# Altium schematic sheet BMS Carrier - Battery Relay Controls.SchDoc: Relay Control
size Tabloid; Author: Liam Sky, Annika Logarta; Revision: 1.0; SheetNumber: 4; SheetTotal: 4; Website: www.uwmidsun.com
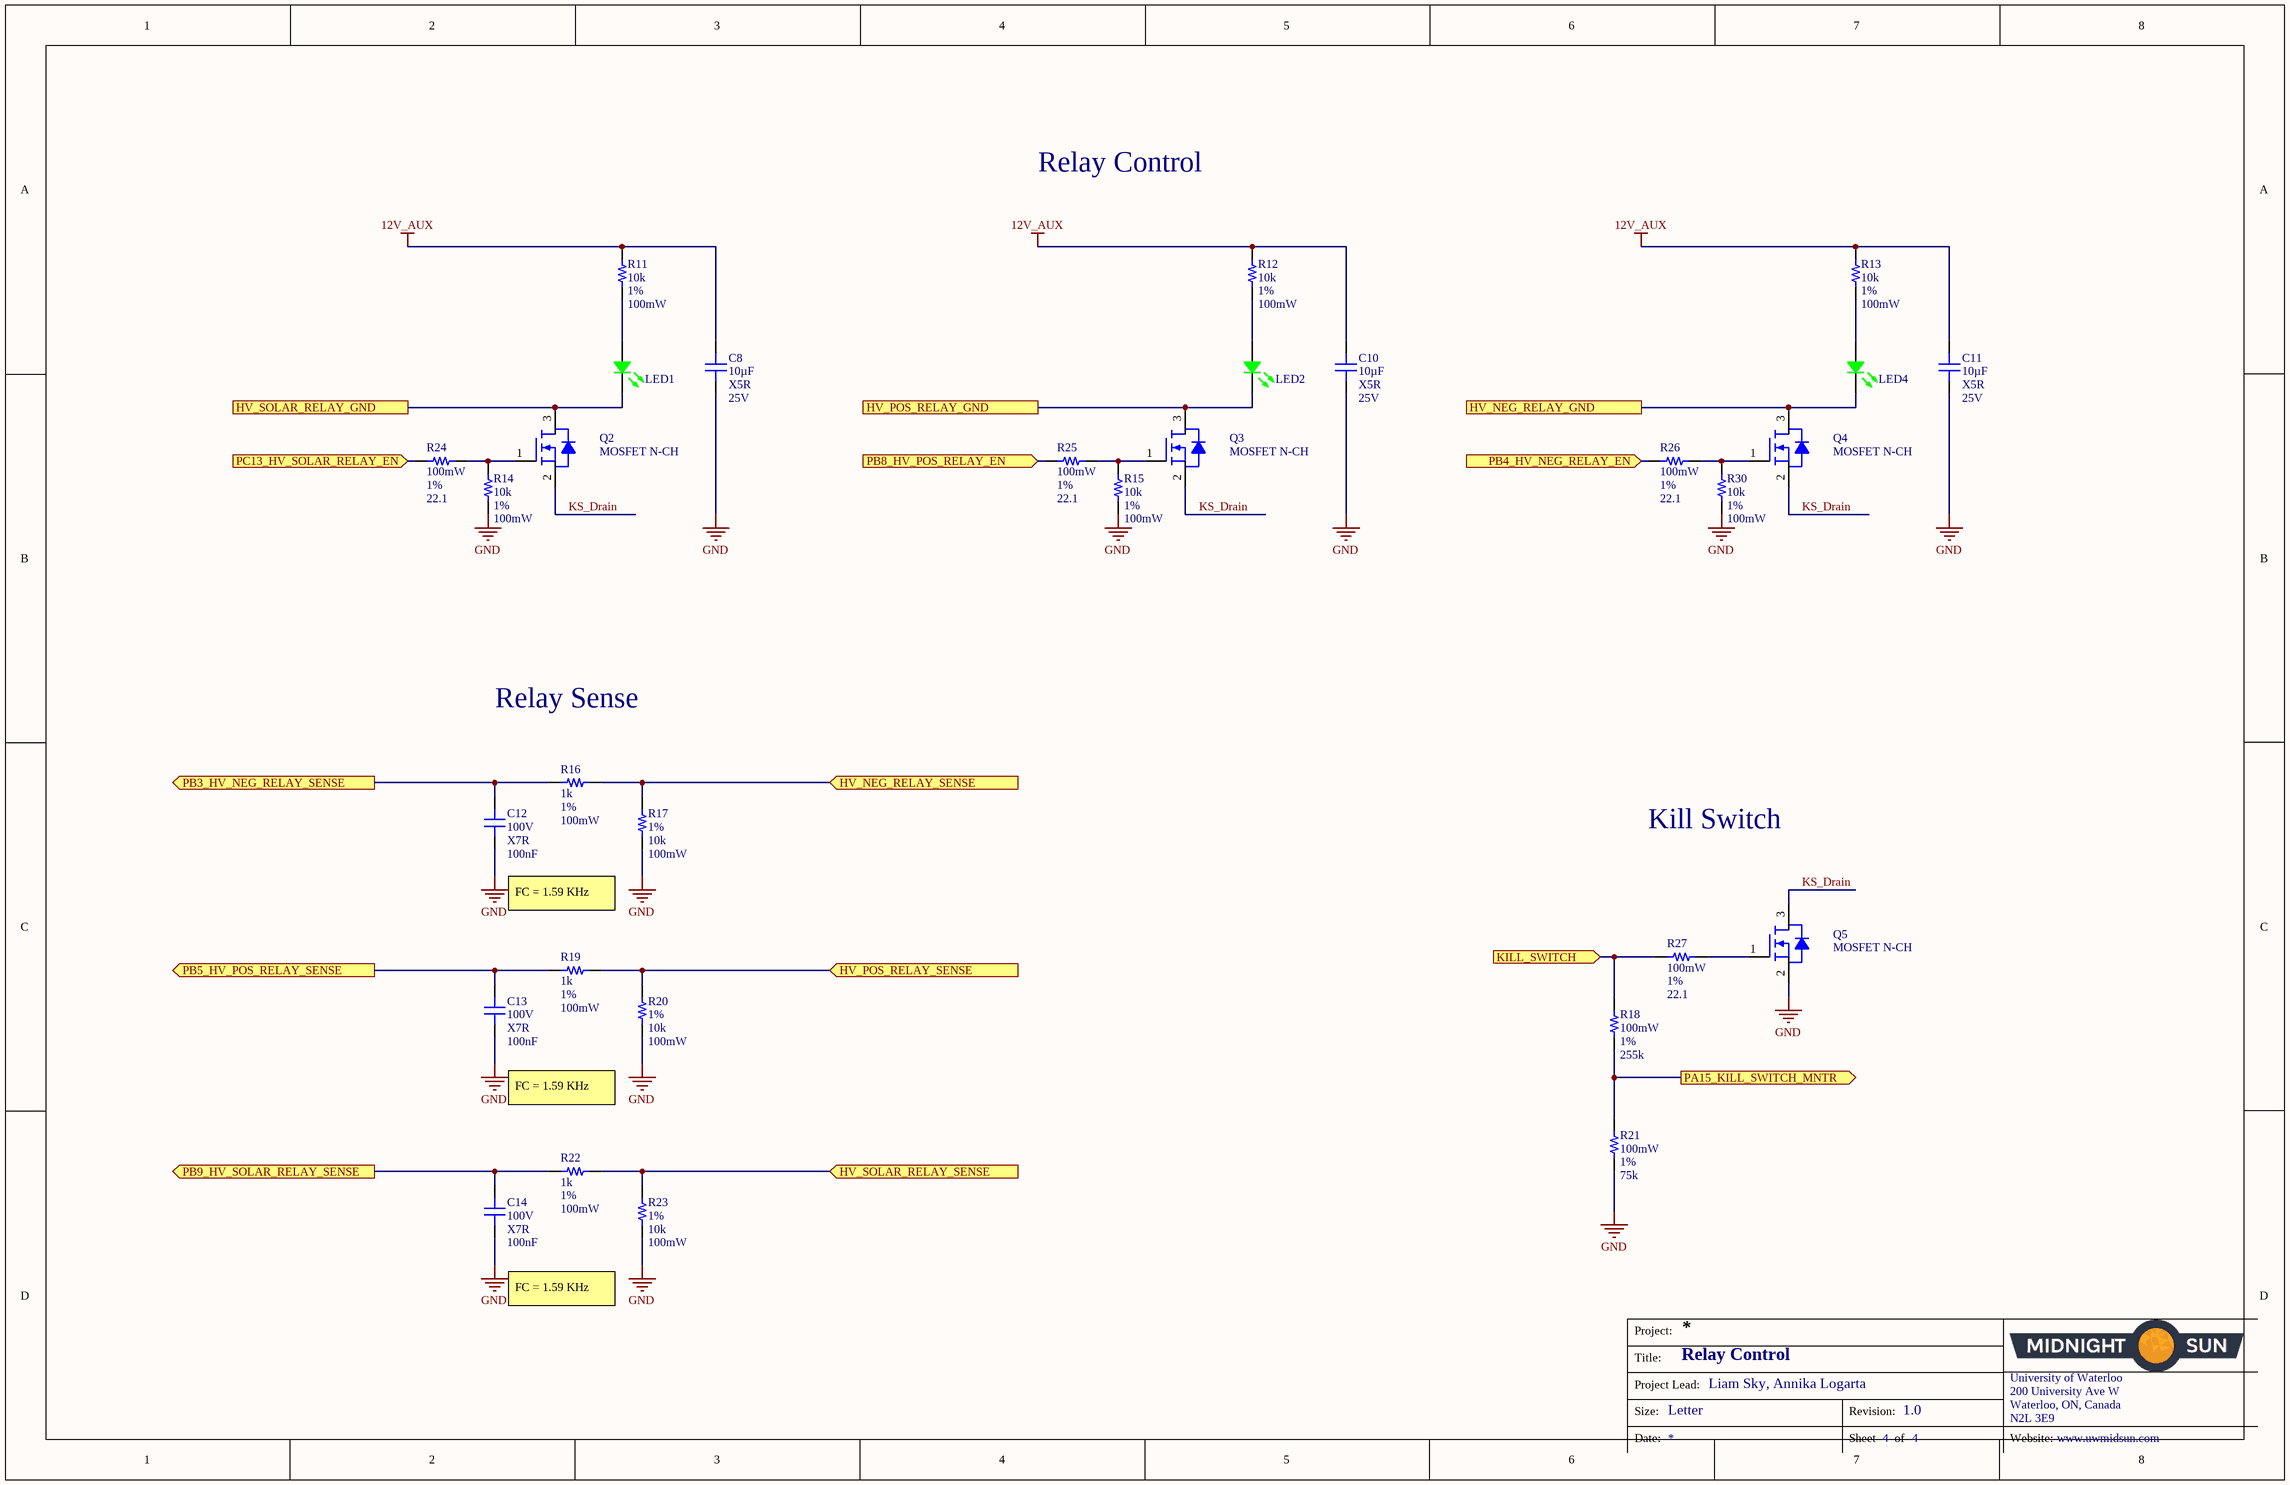
[diagram p0: BMS Carrier - Battery Relay Controls.SchDoc]

## Parts
C8  Capacitance: 10µF  Dielectric Code: X5R  Voltage Rating: 25V  [CAP 0603_1608]  (hidden comment: CAP CER 10UF 25V 20% X5R 0603)
C10  Capacitance: 10µF  Dielectric Code: X5R  Voltage Rating: 25V  [CAP 0603_1608]  (hidden comment: CAP CER 10UF 25V 20% X5R 0603)
C11  Capacitance: 10µF  Dielectric Code: X5R  Voltage Rating: 25V  [CAP 0603_1608]  (hidden comment: CAP CER 10UF 25V 20% X5R 0603)
C12  Voltage Rating: 100V  Dielectric Code: X7R  Capacitance: 100nF  [CAP 0603_1608]  (hidden comment: CAP CER 0.1UF 100V 10% X7R 0603)
C13  Voltage Rating: 100V  Dielectric Code: X7R  Capacitance: 100nF  [CAP 0603_1608]  (hidden comment: CAP CER 0.1UF 100V 10% X7R 0603)
C14  Voltage Rating: 100V  Dielectric Code: X7R  Capacitance: 100nF  [CAP 0603_1608]  (hidden comment: CAP CER 0.1UF 100V 10% X7R 0603)
LED1  LED GREEN CLEAR 2V 0603  [LED 0603_1608]  (value not drawn)
LED2  LED GREEN CLEAR 2V 0603  [LED 0603_1608]  (value not drawn)
LED4  LED GREEN CLEAR 2V 0603  [LED 0603_1608]  (value not drawn)
Q2  MOSFET N-CH  [SOT 23-3]
Q3  MOSFET N-CH  [SOT 23-3]
Q4  MOSFET N-CH  [SOT 23-3]
Q5  MOSFET N-CH  [SOT 23-3]
R11  Resistance: 10k  Tolerance: 1%  Power Rating: 100mW  [RES 0603_1608]  (hidden comment: RES 10K OHM 1% 1/10W 0603)
R12  Resistance: 10k  Tolerance: 1%  Power Rating: 100mW  [RES 0603_1608]  (hidden comment: RES 10K OHM 1% 1/10W 0603)
R13  Resistance: 10k  Tolerance: 1%  Power Rating: 100mW  [RES 0603_1608]  (hidden comment: RES 10K OHM 1% 1/10W 0603)
R14  Resistance: 10k  Tolerance: 1%  Power Rating: 100mW  [RES 0603_1608]  (hidden comment: RES 10K OHM 1% 1/10W 0603)
R15  Resistance: 10k  Tolerance: 1%  Power Rating: 100mW  [RES 0603_1608]  (hidden comment: RES 10K OHM 1% 1/10W 0603)
R16  Resistance: 1k  Tolerance: 1%  Power Rating: 100mW  [RES 0603_1608]  (hidden comment: RES 1K OHM 1% 1/10W 0603)
R17  Tolerance: 1%  Resistance: 10k  Power Rating: 100mW  [RES 0603_1608]  (hidden comment: RES 10K OHM 1% 1/10W 0603)
R18  Power Rating: 100mW  Tolerance: 1%  Resistance: 255k  [RES 0603_1608]  (hidden comment: RES 255K OHM 1% 1/10W 0603)
R19  Resistance: 1k  Tolerance: 1%  Power Rating: 100mW  [RES 0603_1608]  (hidden comment: RES 1K OHM 1% 1/10W 0603)
R20  Tolerance: 1%  Resistance: 10k  Power Rating: 100mW  [RES 0603_1608]  (hidden comment: RES 10K OHM 1% 1/10W 0603)
R21  Power Rating: 100mW  Tolerance: 1%  Resistance: 75k  [RES 0603_1608]  (hidden comment: RES 75K OHM 1% 1/10W 0603)
R22  Resistance: 1k  Tolerance: 1%  Power Rating: 100mW  [RES 0603_1608]  (hidden comment: RES 1K OHM 1% 1/10W 0603)
R23  Tolerance: 1%  Resistance: 10k  Power Rating: 100mW  [RES 0603_1608]  (hidden comment: RES 10K OHM 1% 1/10W 0603)
R24  Power Rating: 100mW  Tolerance: 1%  Resistance: 22.1  [RES 0603_1608]  (hidden comment: RES 22.1 OHM 1% 1/10W 0603)
R25  Power Rating: 100mW  Tolerance: 1%  Resistance: 22.1  [RES 0603_1608]  (hidden comment: RES 22.1 OHM 1% 1/10W 0603)
R26  Power Rating: 100mW  Tolerance: 1%  Resistance: 22.1  [RES 0603_1608]  (hidden comment: RES 22.1 OHM 1% 1/10W 0603)
R27  Power Rating: 100mW  Tolerance: 1%  Resistance: 22.1  [RES 0603_1608]  (hidden comment: RES 22.1 OHM 1% 1/10W 0603)
R30  Resistance: 10k  Tolerance: 1%  Power Rating: 100mW  [RES 0603_1608]  (hidden comment: RES 10K OHM 1% 1/10W 0603)

## Ports
HV_NEG_RELAY_GND, HV_NEG_RELAY_SENSE (in), HV_POS_RELAY_GND, HV_POS_RELAY_SENSE (in), HV_SOLAR_RELAY_GND, HV_SOLAR_RELAY_SENSE (in), KILL_SWITCH (in), PA15_KILL_SWITCH_MNTR (out), PB3_HV_NEG_RELAY_SENSE (out), PB4_HV_NEG_RELAY_EN (in), PB5_HV_POS_RELAY_SENSE (out), PB8_HV_POS_RELAY_EN (in), PB9_HV_SOLAR_RELAY_SENSE (out), PC13_HV_SOLAR_RELAY_EN (in)

## Nets
12V_AUX: C8.2 C10.2 C11.2 R11.2 R12.2 R13.2
GND: C8.1 C10.1 C11.1 C12.1 C13.1 C14.1 Q5.2(S) R14.1 R15.1 R17.1 R20.1 R21.1 R23.1 R30.1
HV_NEG_RELAY_GND: LED4.1 Q4.3(D) ; port HV_NEG_RELAY_GND
HV_NEG_RELAY_SENSE: R16.2 R17.2 ; port HV_NEG_RELAY_SENSE
HV_POS_RELAY_GND: LED2.1 Q3.3(D) ; port HV_POS_RELAY_GND
HV_POS_RELAY_SENSE: R19.2 R20.2 ; port HV_POS_RELAY_SENSE
HV_SOLAR_RELAY_GND: LED1.1 Q2.3(D) ; port HV_SOLAR_RELAY_GND
HV_SOLAR_RELAY_SENSE: R22.2 R23.2 ; port HV_SOLAR_RELAY_SENSE
KILL_SWITCH: R18.2 R27.1 ; port KILL_SWITCH
KS_Drain: Q2.2(S) Q3.2(S) Q4.2(S) Q5.3(D)
PA15_KILL_SWITCH_MNTR: R18.1 R21.2 ; port PA15_KILL_SWITCH_MNTR
PB3_HV_NEG_RELAY_SENSE: C12.2 R16.1 ; port PB3_HV_NEG_RELAY_SENSE
PB4_HV_NEG_RELAY_EN: R26.1 ; port PB4_HV_NEG_RELAY_EN
PB5_HV_POS_RELAY_SENSE: C13.2 R19.1 ; port PB5_HV_POS_RELAY_SENSE
PB8_HV_POS_RELAY_EN: R25.1 ; port PB8_HV_POS_RELAY_EN
PB9_HV_SOLAR_RELAY_SENSE: C14.2 R22.1 ; port PB9_HV_SOLAR_RELAY_SENSE
PC13_HV_SOLAR_RELAY_EN: R24.1 ; port PC13_HV_SOLAR_RELAY_EN
NetLED1_2: LED1.2 R11.1
NetLED2_2: LED2.2 R12.1
NetLED4_2: LED4.2 R13.1
NetQ2_1: Q2.1(G) R14.2 R24.2
NetQ3_1: Q3.1(G) R15.2 R25.2
NetQ4_1: Q4.1(G) R26.2 R30.2
NetQ5_1: Q5.1(G) R27.2

## Notes on the sheet
- Relay Control
- Relay Sense
- Kill Switch
- FC = 1.59 KHz
- Project:
- Title:
- Size:
- Project Lead:
- Letter
- Revision:
- University of Waterloo
- 200 University Ave W
- Waterloo, ON, Canada
- N2L 3E9
- Date:
- Sheet
- of
- Website:

## Library data of the parts
C8 C10 C11 = CMP-013-0018-6: 10µF ±20% 25V Ceramic Capacitor X5R 0603 (1608 Metric); Tolerance: 20%; Case/Package: 0603
C12-C14 = CMP-013-0022-14: Ceramic Capacitor, Multilayer, Ceramic, 100V, 10% +Tol, 10% -Tol, X7R, 15% TC, 0.1uF, Surface Mount, 0603; Case/Package: 0603; Tolerance: 10%
LED1 LED2 LED4 = CMP-011-0001-9: Green 562nm LED Indication - Discrete 2V 0603 (1608 Metric); Forward Current: 20mA; Case/Package: 0603 (1608 Metric); Colour: Green; Forward Voltage: 2V
Q2-Q5 = CMP-003-0074-4: N-Channel 30V 6.2A (Ta) 900mW (Ta) Surface Mount SOT-23; Vgs (Max): 20V; Vgs(th) (Max) @ Id: 1.8; Case/Package: SOT 23-3; Power: 900mW
R11-R15 R17 R20 R23 R30 = CMP-009-00190-14: 10 ±1% 0.1W, 1/10W Chip Resistor 0603 (1608 Metric) Automotive AEC-Q200 Thick Film; Voltage Rating: 75V; Temperature Coefficient: 100ppm/°C; Case/Package: 0603
R16 R19 R22 = CMP-009-00014-17: 1 kOhms ±1% 0.1W, 1/10W Chip Resistor 0603 (1608 Metric) Moisture Resistant Thick Film; Voltage Rating: 75V; Temperature Coefficient: 100ppm/°C; Case/Package: 0603
R18 = CMP-010-0022-7: 255k Ohm ±1% 0.1W, 1/10W Chip Resistor 0603 (1608 Metric) Moisture Resistant Thick Film; Voltage Rating: 75V; Temperature Coefficient: 100ppm/°C; Case/Package: 0603
R21 = CMP-00026-1: Fixed Resistor, Metal Glaze/thick Film, 0.1W, 75000ohm, 75V, 1% +/-Tol, 100ppm/Cel, Surface Mount, 0603; Temperature Coefficient: 100ppm/°C; Case/Package: 0603; Voltage Rating: 75V
R24-R27 = CMP-009-00193-9: Fixed Resistor, Metal Glaze/thick Film, 0.1W, 22.1ohm, 75V, 1% +/-Tol, 100ppm/Cel, Surface Mount, 0603; Temperature Coefficient: 100ppm/°C; Case/Package: 0603; Voltage Rating: 75V